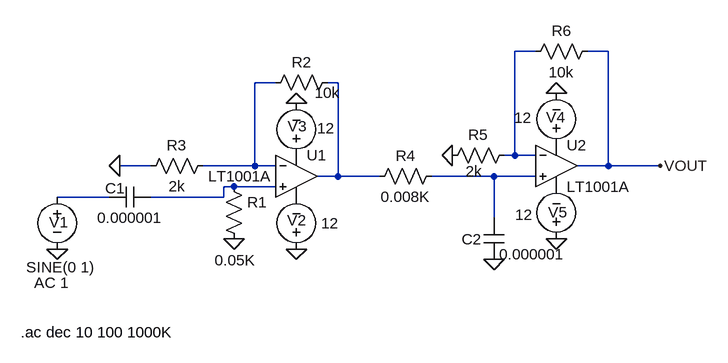
[diagram p0: schematic Band-Pass Filter using Op Amp.asc]
Band-Pass Filter using Op Amp.asc, the LTspice schematic file:
Version 4
SHEET 1 880 680
WIRE 544 32 512 32
WIRE 656 32 624 32
WIRE 144 80 112 80
WIRE 240 80 224 80
WIRE 512 192 512 32
WIRE 512 192 496 192
WIRE 544 192 512 192
WIRE -48 208 -96 208
WIRE 112 208 112 80
WIRE 112 208 32 208
WIRE 144 208 112 208
WIRE 656 208 656 32
WIRE 656 208 608 208
WIRE 736 208 656 208
WIRE 240 224 240 80
WIRE 240 224 208 224
WIRE 304 224 240 224
WIRE 480 224 384 224
WIRE 544 224 480 224
WIRE 80 240 64 240
WIRE 144 240 80 240
WIRE -112 256 -192 256
WIRE 64 256 64 240
WIRE 64 256 -48 256
WIRE 480 288 480 224
FLAG 176 112 0
FLAG 176 336 0
FLAG 80 320 0
FLAG -96 208 0
FLAG -192 336 0
FLAG 416 192 0
FLAG 480 352 0
FLAG 576 320 0
FLAG 576 96 0
FLAG 736 208 VOUT
SYMBOL OpAmps\\LT1001A 176 160 R0
WINDOW 3 -136 64 Left 2
SYMATTR InstName U1
SYMBOL OpAmps\\LT1001A 576 144 R0
SYMATTR InstName U2
SYMBOL res 64 224 R0
WINDOW 3 -14 129 Left 2
SYMATTR Value 0.05K
SYMATTR InstName R1
SYMBOL res 240 64 R90
WINDOW 0 0 56 VBottom 2
WINDOW 3 16 16 VTop 2
SYMATTR InstName R2
SYMATTR Value 10k
SYMBOL res 48 192 R90
WINDOW 0 0 56 VBottom 2
WINDOW 3 32 56 VTop 2
SYMATTR InstName R3
SYMATTR Value 2k
SYMBOL cap -48 240 R90
WINDOW 0 18 55 VBottom 2
WINDOW 3 32 32 VTop 2
SYMATTR InstName C1
SYMATTR Value 0.000001
SYMBOL voltage -192 240 R0
WINDOW 0 -12 55 Left 2
WINDOW 3 -48 124 Left 2
WINDOW 123 -35 148 Left 2
WINDOW 39 0 0 Left 0
SYMATTR InstName V1
SYMATTR Value SINE(0 1)
SYMATTR Value2 AC 1
SYMBOL voltage 176 352 R180
WINDOW 0 -15 60 Left 2
WINDOW 3 -65 56 Left 2
WINDOW 123 0 0 Left 0
WINDOW 39 0 0 Left 0
SYMATTR InstName V2
SYMATTR Value 12
SYMBOL voltage 176 208 R180
WINDOW 0 -16 61 Left 2
WINDOW 3 -59 58 Left 2
WINDOW 123 0 0 Left 0
WINDOW 39 0 0 Left 0
SYMATTR InstName V3
SYMATTR Value 12
SYMBOL voltage 576 192 R180
WINDOW 0 -14 59 Left 2
WINDOW 3 38 58 Left 2
WINDOW 123 0 0 Left 0
WINDOW 39 0 0 Left 0
SYMATTR InstName V4
SYMATTR Value 12
SYMBOL voltage 576 336 R180
WINDOW 0 -17 57 Left 2
WINDOW 3 36 53 Left 2
WINDOW 123 0 0 Left 0
WINDOW 39 0 0 Left 0
SYMATTR InstName V5
SYMATTR Value 12
SYMBOL res 400 208 R90
WINDOW 0 0 56 VBottom 2
WINDOW 3 32 56 VTop 2
SYMATTR InstName R4
SYMATTR Value 0.008K
SYMBOL cap 464 288 R0
WINDOW 0 -34 33 Left 2
SYMATTR InstName C2
SYMATTR Value 0.000001
SYMBOL res 512 176 R90
WINDOW 0 0 56 VBottom 2
WINDOW 3 25 63 VTop 2
SYMATTR InstName R5
SYMATTR Value 2k
SYMBOL res 640 16 R90
WINDOW 0 0 56 VBottom 2
WINDOW 3 32 56 VTop 2
SYMATTR InstName R6
SYMATTR Value 10k
TEXT -248 464 Left 2 !.ac dec 10 100 1000K

The netlist it stands for:
* Band-Pass Filter using Op Amp.asc
XU1 N005 N002 P001 P002 N003 LT1001  ; LT1001A, pins In+ In- V+ V- OUT
XU2 N004 N001 P003 P004 VOUT LT1001  ; LT1001A, pins In+ In- V+ V- OUT
R1 N005 0 0.05K
R2 N003 N002 10k
R3 N002 0 2k
C1 N005 N006 0.000001
V1 N006 0 SINE(0 1) AC 1
V2 0 P002 12
V3 P001 0 12
V4 P003 0 12
V5 0 P004 12
R4 N004 N003 0.008K
C2 N004 0 0.000001
R5 N001 0 2k
R6 VOUT N001 10k
.ac dec 10 100 1000K
.lib LTC.lib
.backanno
.end